# EAGLE schematic rohan (EAGLE 8.0.1)
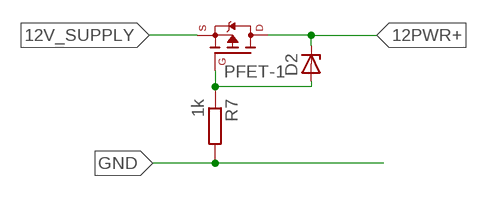
[diagram p0: schematic, sheet 1]

## Parts
D2  1SMA5925BT3G  [DO214AC]
PFET-1  FQP47P06NORMAL  [FQP47P06-NORMAL]
R7  1k  R-EU_R0603  [R0603]

## Nets
12PWR+ [PWR]: D2.C PFET-1.2(D)
12V_SUPPLY [PWR]: PFET-1.3(S)
GND [PWR]: R7.2
N$2: D2.A PFET-1.1(G) R7.1

## Library data of the parts
D2 = 1sma59xx_10:1SMA59*BT3G: 1SMA59xxBT3G Series 1.5 Watt Plastic Surface Mount Zener Voltage Regulators Source: http://www.onsemi.com/pub_link/Collateral/1SMA5913BT3-D.PDF; MF: ON Semiconductor; MPN: 1SMA5925BT3G; OC_FARNELL: 1431147; OC_NEWARK: 71J9198
PFET-1 = FQP47P06:FQP47P06
R7 = resistor:R-EU_: RESISTOR, European symbol

## Net classes
5 PWR: width 1.016 mm, drill 1.016 mm, clearance 0.381 mm